# Altium schematic sheet AP64502Q_PINOUT.SchDoc
size A; SheetNumber: 12; SheetTotal: 12
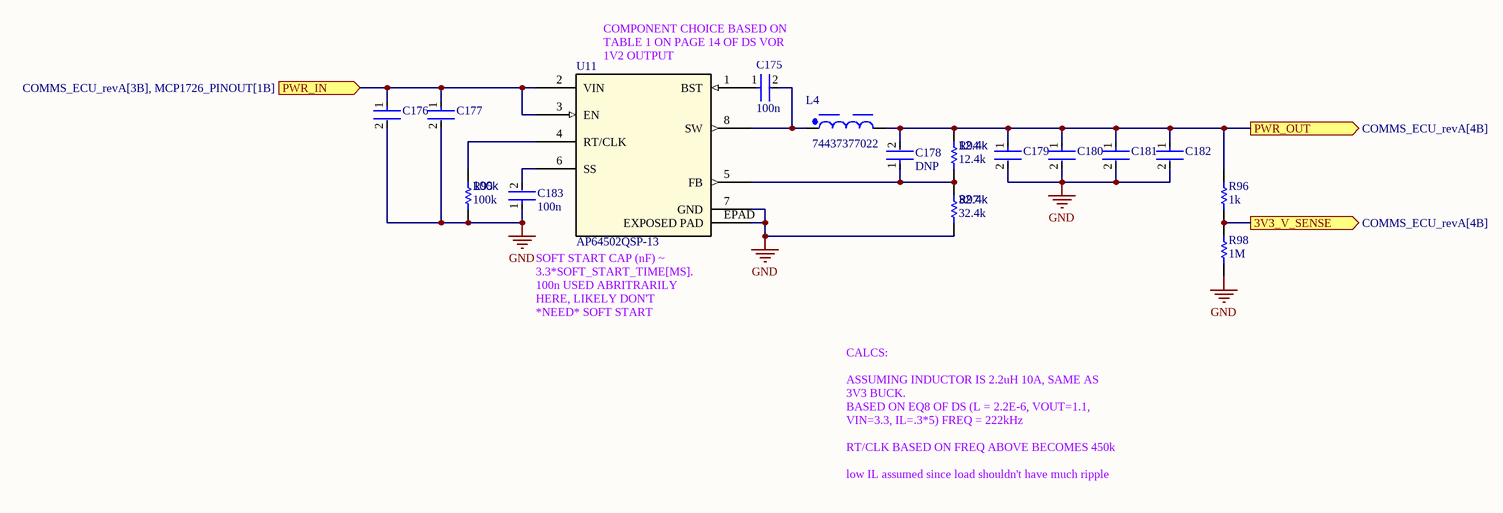
[diagram p0: AP64502Q_PINOUT.SchDoc]

## Parts
C175  100n  [FP-0402-L_1_0_0_05-W_0_5-IPC_A]
C176  12103D106KAT2A  [FP-1210-L_3_3_0_4-W_2_5_0-MFG]  (value not drawn)
C177  12103D106KAT2A  [FP-1210-L_3_3_0_4-W_2_5_0-MFG]  (value not drawn)
C178  DNP  [FP-0402-L_1_0_0_05-W_0_5-IPC_A]
C179  CGA9N3X7R1C476M230KB  [FP-CGA9P-IPC_A]  (value not drawn)
C180  CGA9N3X7R1C476M230KB  [FP-CGA9P-IPC_A]  (value not drawn)
C181  CGA9N3X7R1C476M230KB  [FP-CGA9P-IPC_A]  (value not drawn)
C182  DNP  [FP-CGA9P-IPC_A]  (value not drawn)
C183  100n  [FP-0402-L_1_0_0_05-W_0_5-IPC_A]
L4  74437377022  [WE-LHMI_1335]
R94  12.4k  [R0603B]
R95  100k  [R0603B]
R96  1k  [R0603B]
R97  32.4k  [R0603B]
R98  1M  [R0603B]
U11  AP64502QSP-13  [SOIC127P600X163_HS-9N]

## Ports
3V3_V_SENSE (out, see COMMS_ECU_revA[4B]), PWR_IN (in, see COMMS_ECU_revA[3B], MCP1726_PINOUT[1B]), PWR_OUT (out, see COMMS_ECU_revA[4B])

## Nets
GND: C176.2 C177.2 C179.2 C180.2 C181.2 C182.2 C183.1 R95.1 R97.1 R98.1 U11.7(GND) U11.EPAD(EXPOSED_PAD)
3V3_V_SENSE: R96.1 R98.2 ; port 3V3_V_SENSE
PWR_IN: C176.1 C177.1 U11.2(VIN) U11.3(EN) ; port PWR_IN
PWR_OUT: C178.2 C179.1 C180.1 C181.1 C182.1 L4.2 R94.2 R96.2 ; port PWR_OUT
NetC175_1: C175.1 U11.1(BST)
NetC175_2: C175.2 L4.1 U11.8(SW)
NetC178_1: C178.1 R94.1 R97.2 U11.5(FB)
NetC183_2: C183.2 U11.6(SS)
NetR95_2: R95.2 U11.4(RT/CLK)

## Notes on the sheet
- COMPONENT CHOICE BASED ON TABLE 1 ON PAGE 14 OF DS VOR 1V2 OUTPUT
- (near U11) SOFT START CAP (nF) ~ 3.3*SOFT_START_TIME[MS]. 100n USED ABRITRARILY HERE, LIKELY DON'T *NEED* SOFT START
- CALCS:
  ASSUMING INDUCTOR IS 2.2uH 10A, SAME AS 3V3 BUCK.
  BASED ON EQ8 OF DS (L = 2.2E-6, VOUT=1.1, VIN=3.3, IL=.3*5) FREQ = 222kHz
  RT/CLK BASED ON FREQ ABOVE BECOMES 450k
  low IL assumed since load shouldn't have much ripple

## Library data of the parts
C175 C178 C183 = CMP-001-00058-1: LARGE PADS, 0402 CAP, CHANGE COMMENT TO MATCH REAL P/N; Capacitor Type: Ceramic; Min Operating Temperature: -55°C; Mounting Technology: Surface Mount; Pins: 2; Case/Package: 0402; RoHS Compliant: Yes; Max Operating Temperature: 85°C
C176 C177 = CMP-2000-05477-2: General Purpose Ceramic Capacitor, 1210, 10uF, 10%, X5R, 15%, 25V; Lead Free: Lead Free; Max Operating Temperature: 85°C; REACH SVHC: No SVHC; Depth: 2.5mm; Packaging: Tape and Reel; Min Operating Temperature: -55°C; Height: 2.29mm; Construction: Flat; Case Code (Imperial): 1210; Radiation Hardening: No; Voltage: 25V; Case/Package: 1210; Series: -; Dielectric: X5R; Length: 3.2mm; Thickness: 0.11inch; Package Quantity: 1; Termination: SMD/SMT; Case Code (Metric): 3225; Voltage Rating (DC): 25V; Voltage Rating: 25V; Contact Plating: Tin; RoHS Compliant: Yes; Mount: Surface Mount; Width: 0.098inch; Capacitance: 10uF; Tolerance: 10%
C179-C182 = CMP-08246-000988-1: Cap Ceramic 47uF 16V X7R 20% Pad SMD 2220 +125°C Automotive T/R; Length: 5.7mm; Packaging: Tape and Reel; Width: 5mm; Case Code (Imperial): 2220; Thickness: 0.091inch; Lead Free: Lead Free; Capacitance: 47uF; Voltage Rating (DC): 16V; Mount: Surface Mount; Composition: Ceramic; Termination: SMD/SMT; Ratings: AEC-Q200; Case/Package: 2220; Weight: 0.016932oz; REACH SVHC: No SVHC; Voltage Rating: 16V; Max Operating Temperature: 125°C; Case Code (Metric): 5750; Package Quantity: 1; Min Operating Temperature: -55°C; Depth: 5mm; Height: 2.3mm; Tolerance: 20%; Dielectric: X7R
L4 = CMP-1353-00019-6: Inductor Power Shielded/Molded Wirewound 2.2uH 20% 100KHz Powdered Iron 10A 0.008Ohm DCR T/R Automotive AEC-Q200; Series Resistance: 8mΩ; DC Resistance (DCR): 7.2mΩ; Inductance: 2.2µH; Saturation Current: 14.2A; Core Material: Composite, Ferrite; Frequency: 22MHz; Mount: Surface Mount; Ambient Temperature Range Low: -40°C; Max DC Current: 10A; Depth: 12.6mm; Height: 3.3mm; Tolerance: 20%; REACH SVHC: Unknown; Width: 12.6mm; Max Operating Temperature: 125°C; Height - Seated (Max): 3.5052mm; Composition: Wirewound; Inductance Tolerance: 20%; Length: 13.5mm; RMS Current (Irms): 10A; Termination: SMD/SMT; Test Frequency: 100kHz; Current Rating: 10A; Case/Package: Nonstandard; Shielding: Shielded; Ambient Temperature Range High: 85°C; Min Operating Temperature: -40°C; Self Resonant Frequency: 22MHz; RoHS: Compliant
R94-R98 = CMP-009-00002-14: Resistor
  R94: Value: 12.4k
  R95: Value: 100k
  R96: Value: 1k
  R97: Value: 32.4k
  R98: Value: 1M
U11 = CMP-019-00063-1: DC-DC Switching Synchronous Buck Regulator, Adjustable, 3.8-40 V in, 0.8-40 V out, 3 A out, HSOIC-8; Max Supply Voltage: 40V; Max Operating Temperature: 125°C; Min Operating Temperature: -40°C